# EAGLE design Urzeitcode - 18F16Q41 (EAGLE 7.2.0)
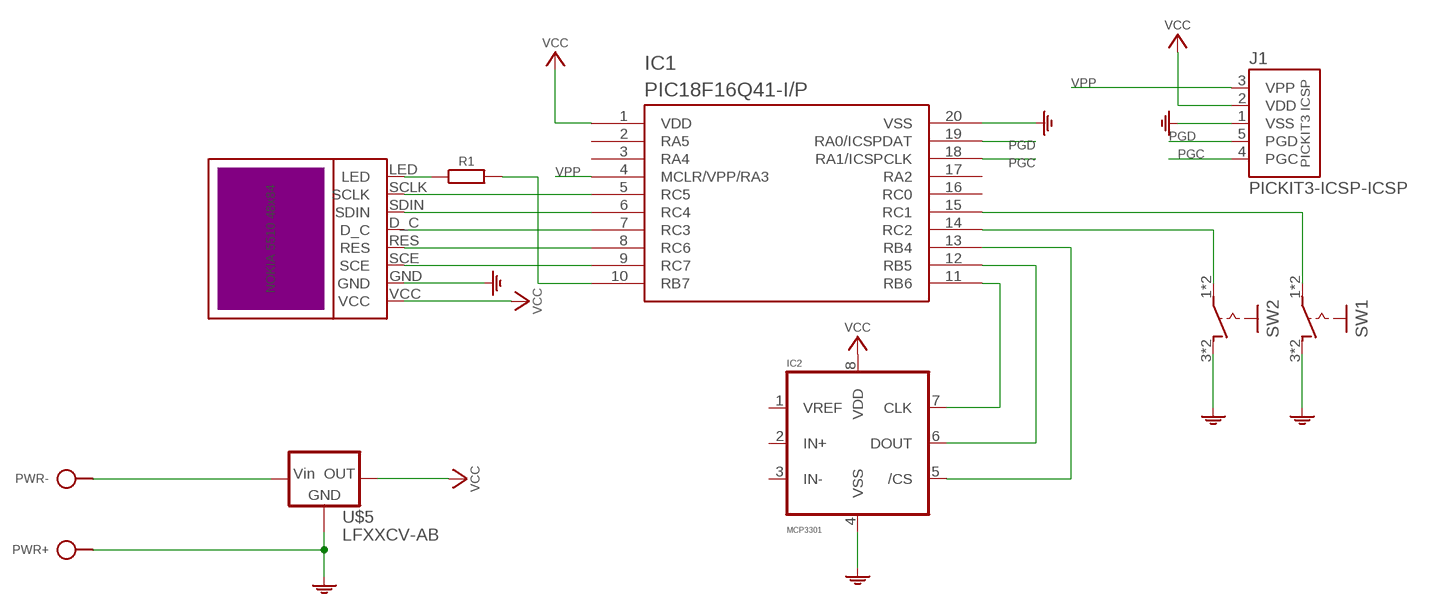
[diagram p0: schematic, sheet 1]

## Parts
IC1  PIC18F16Q41-I/P  [DIL20-3/V]
IC2  MCP3301  [DIL08]
J1  PICKIT3-ICSP-ICSP  [PIC-ICSP]
PWR  SPAD+-+-  [SPAD+-]
R1  R-H0204/15-V  [0204/15-V]
SW1  PB-1P-1T2P1T  [PB-2P1T]
SW2  PB-1P-1T2P1T  [PB-2P1T]
U$2  NOKIA-5510-48X84-MODULE  [MOD-LCD5110]
U$5  LFXXCV-AB  [TO220AB]

## Nets
GND: IC1.20(VSS) IC2.4(VSS) J1.1(VSS) PWR.2 SW1.3(S) SW1.4(S) SW2.3(S) SW2.4(S) U$2.GND U$5.2(GND)
N$1: IC1.5(RC5) U$2.SCLK
N$2: IC1.6(RC4) U$2.SDIN
N$3: IC1.7(RC3) U$2.D_C
N$4: IC1.8(RC6) U$2.RES
N$5: IC1.9(RC7) U$2.SCE
N$6: R1.1 U$2.LED
N$7: IC1.10(RB7) R1.2
N$8: IC1.13(RB4) IC2.5(/CS)
N$9: IC1.12(RB5) IC2.6(DOUT)
N$10: IC1.11(RB6) IC2.7(CLK)
N$11: IC1.14(RC2) SW2.1(P) SW2.2(P)
N$12: IC1.15(RC1) SW1.1(P) SW1.2(P)
N$13: PWR.1 U$5.1(VIN)
PGC: IC1.18(RA1/ICSPCLK) J1.4(PGC)
PGD: IC1.19(RA0/ICSPDAT) J1.5(PGD)
VCC: IC1.1(VDD) IC2.8(VDD) J1.2(VDD) U$2.VCC U$5.3(VOUT)
VPP: IC1.4(MCLR/VPP/RA3) J1.3(VPP)
Unconnected: IC1.2(RA5) IC1.3(RA4) IC1.16(RC0) IC1.17(RA2) IC2.1(VREF) IC2.2(IN+) IC2.3(IN-)

## Library data of the parts
IC1 = mcu:PIC18F16Q41-I/P
IC2 = ic:MCP3301
J1 = pinconn:PICKIT3-ICSP
PWR = pad:SPAD+-
R1 = r:R-H
SW1 SW2 = sw:PB-1P-1T
U$2 = lcd:NOKIA-5510-48X84
U$5 = ic:LFXXCV

## Board
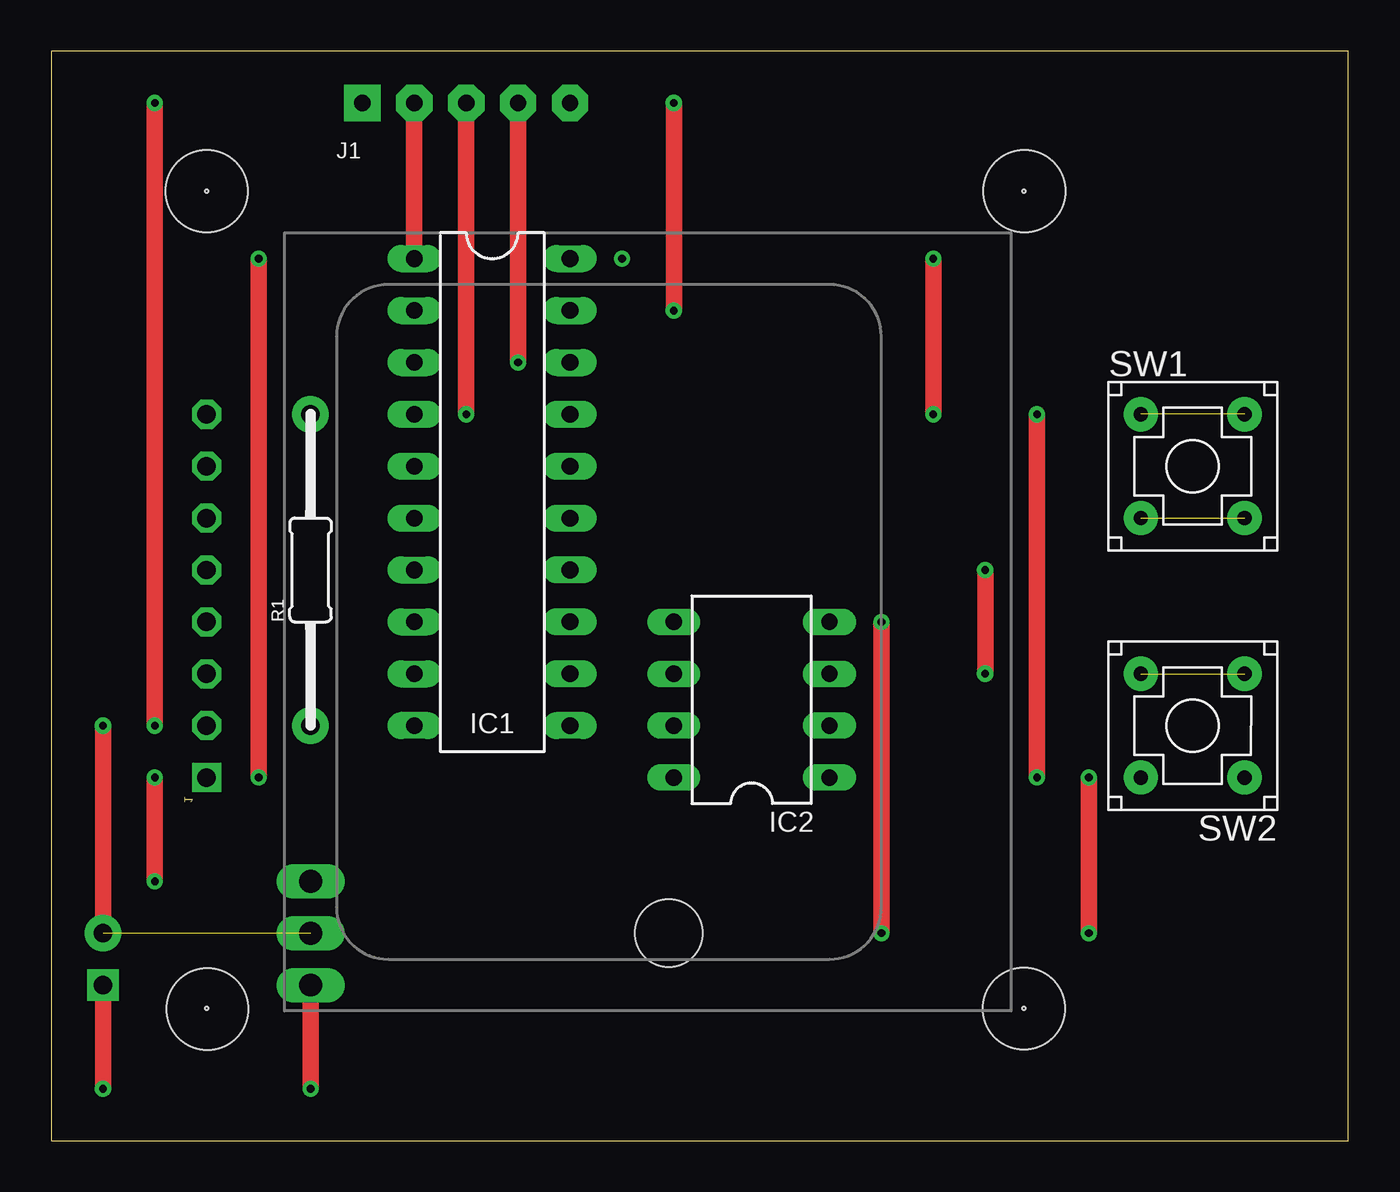
[diagram p1: board, top side]
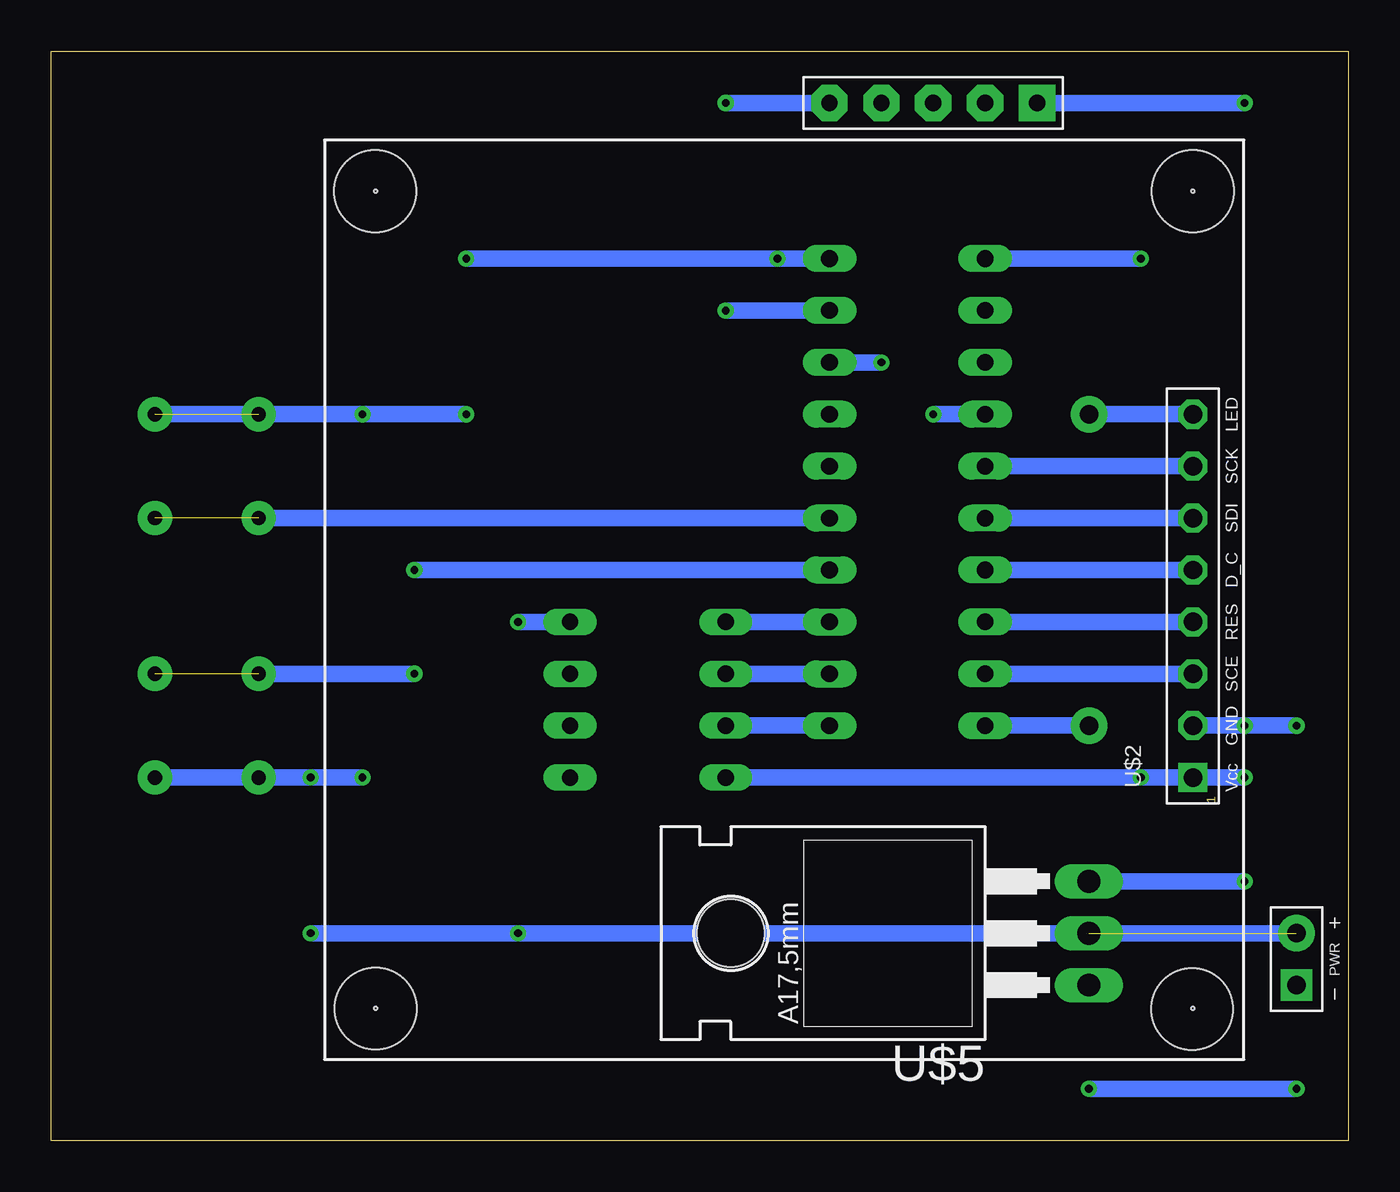
[diagram p2: board, bottom side, seen from below]

Size 63.5 x 53.34 mm. Coordinates in mm from the lower left corner, seen from the top.
Outline: 0,0 63.5,0 63.5,53.34 0,53.34 0,0
Copper layers (1*16): Top 0.035mm / dielectric 1.5mm / Bottom 0.035mm
Design rules "default": minimum track width 10mil, minimum drill 24mil, track to track 8mil, track to pad 8mil, pad to pad 8mil, via to via 8mil, smd to smd 8mil, copper to edge 40mil, drill to drill 8mil, minimum pad ring 10mil, minimum via ring 8mil, stop-mask expansion 4mil, vias tented up to drill 0mil, thermal gap 10mil
Holes 4 mm at 7.62,46.48 7.65,6.45 47.65,46.48 47.61,6.47

### Footprints (pad centres in the part's own frame; a part is rotated, then mirrored left to right if it is on the bottom)
DIL20-3/V = drill 0.813 long: 1 -3.81,8.89; 2 -3.81,6.35; 3 -3.81,3.81; 4 -3.81,1.27; 5 -3.81,-1.27; 6 -3.81,-3.81; 7 -3.81,-6.35; 8 -3.81,-8.89; 9 -3.81,-11.43; 10 -3.81,-13.97; 11 3.81,-13.97; 12 3.81,-11.43; 13 3.81,-8.89; 14 3.81,-6.35; 15 3.81,-3.81; 16 3.81,-1.27; 17 3.81,1.27; 18 3.81,3.81; 19 3.81,6.35; 20 3.81,8.89
DIL08 = drill 0.8 pad 1.27 long: 1 -3.81,3.81; 2 -3.81,1.27; 3 -3.81,-1.27; 4 -3.81,-3.81; 5 3.81,-3.81; 6 3.81,-1.27; 7 3.81,1.27; 8 3.81,3.81
PIC-ICSP = drill 0.8 pad 1.778 square: 1 0,0 | drill 0.8 pad 1.778 octagon: 2 2.54,0; 3 5.08,0; 4 7.62,0; 5 10.16,0
SPAD+- = drill 0.9 pad 1.524 square: 1 0,-1.27 | drill 0.9 pad 1.778: 2 0,1.27
0204/15-V = drill 0.9 pad 1.778: 1 0,7.62; 2 0,-7.62
PB-2P1T = drill 0.7 pad 1.676: 1 2.54,-2.54; 2 -2.54,-2.54; 3 2.54,2.54; 4 -2.54,2.54
MOD-LCD5110 = drill 2.032 pad 2.54: 1 -19.809,19.05; 2 20.19,19.05; 3 -19.809,-20.95; 4 20.19,-20.95 | drill 0.9 pad 1.422 octagon: D_C -1.27,19.06; GND 6.35,19.06; LED -8.89,19.06; RES 1.27,19.06; SCE 3.81,19.06; SCLK -6.35,19.06; SDIN -3.81,19.06 | drill 0.9 pad 1.422 square: VCC 8.89,19.06 | hole 0.15: -19.809,19.05; 20.19,19.05; -19.81,-20.95; 20.19,-20.95
TO220AB = drill 1.118 long: 1 -2.54,-6.35; 2 0,-6.35; 3 2.54,-6.35 | hole 3.302: 0,11.176

### Placement (x,y rotation side)
IC1  21.59,34.29 0 top
IC2  34.29,21.59 180 top
J1  15.24,50.8 0 top
PWR  2.54,8.89 0 bottom
R1  12.7,27.94 0 top
SW1  55.88,33.02 0 top
SW2  55.88,20.32 180 top
U$2  26.67,26.67 270 bottom
U$5  19.05,10.16 90 bottom

### Tracks (layer width: path | path; a pad name or v marks a point on that pad's centre or on a via)
GND  (via drill 0.38)  (2 unrouted)
  Top 0.813: v48.26,35.56 v48.26,17.78 | PWR.2 v2.54,20.32 | v43.18,35.56 v43.18,43.18 | v40.64,25.4 v40.64,10.16 | v50.8,10.16 v50.8,17.78 | v5.08,50.8 v5.08,20.32
  Bottom 0.813: v43.18,43.18 v27.94,43.18 IC1.20 | PWR.2 v40.64,10.16 v50.8,10.16 | v40.64,25.4 IC2.4 | SW2.4 SW2.3 v50.8,17.78 v48.26,17.78 | U$2.GND v5.08,20.32 v2.54,20.32 | SW1.3 v48.26,35.56 v43.18,35.56 | J1.1 v5.08,50.8
  other vias: 2.54,10.16
N$1
  Bottom 0.813: IC1.5 U$2.SCLK
N$2
  Bottom 0.813: U$2.SDIN IC1.6
N$3
  Bottom 0.813: IC1.7 U$2.D_C
N$4
  Bottom 0.813: U$2.RES IC1.8
N$5
  Bottom 0.813: U$2.SCE IC1.9
N$6
  Bottom 0.813: R1.1 U$2.LED
N$7
  Bottom 0.813: IC1.10 R1.2
N$8
  Bottom 0.813: IC2.5 IC1.13
N$9
  Bottom 0.813: IC1.12 IC2.6
N$10
  Bottom 0.813: IC1.11 IC2.7
N$11  (via drill 0.38)  (1 unrouted)
  Top 0.813: v45.72,22.86 v45.72,27.94
  Bottom 0.813: SW2.1 v45.72,22.86 | v45.72,27.94 IC1.14
N$12  (1 unrouted)
  Bottom 0.813: SW1.2 IC1.15
N$13  (via drill 0.38)
  Top 0.813: U$5.1 v12.7,2.54 | v2.54,2.54 PWR.1
  Bottom 0.813: v12.7,2.54 v2.54,2.54
PGC  (via drill 0.38)
  Top 0.813: J1.4 v22.86,38.1
  Bottom 0.813: v22.86,38.1 IC1.18
PGD  (via drill 0.38)
  Top 0.813: v30.48,40.64 v30.48,50.8
  Bottom 0.813: IC1.19 v30.48,40.64 | v30.48,50.8 J1.5
VCC  (via drill 0.38)
  Top 0.813: v10.16,43.18 v10.16,17.78 | IC1.1 J1.2 | v5.08,12.7 v5.08,17.78
  Bottom 0.813: v10.16,43.18 IC1.1 | IC2.8 v5.08,17.78 v10.16,17.78 U$2.VCC | U$5.3 v5.08,12.7
  other vias: 17.78,43.18 17.78,43.18
VPP  (via drill 0.38)
  Top 0.813: J1.3 v20.32,35.56
  Bottom 0.813: v20.32,35.56 IC1.4
  other vias: 20.32,50.8